# EAGLE design Jason_BlinkyB (EAGLE 8.3.2)
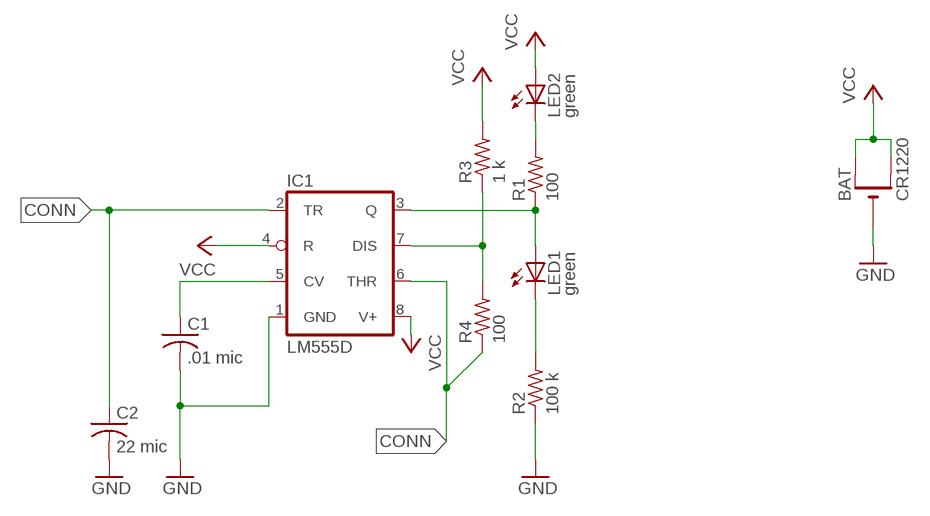
[diagram p0: schematic, sheet 1]

## Parts
BAT  CR1220  CR1220SMT  [CR1220-SMD]
C1  .01 mic  C-USC0805  [C0805]
C2  22 mic  C-USC0805  [C0805]
IC1  LM555D  [SO08]
LED1  green  LEDCHIPLED_0805  [CHIPLED_0805]
LED2  green  LEDCHIPLED_0805  [CHIPLED_0805]
R1  100  R-US_R0805  [R0805]
R2  100 k  R-US_R0805  [R0805]
R3  1 k  R-US_R0805  [R0805]
R4  100  R-US_R0805  [R0805]

## Nets
CONN: C2.1 IC1.2(TR) IC1.6(THR) R4.1
GND: BAT.- C1.2 C2.2 IC1.1(GND) R2.1
N$1: LED2.C R1.2
N$2: IC1.3(Q) LED1.A R1.1
N$3: LED1.C R2.2
N$4: IC1.7(DIS) R3.1 R4.2
N$9: C1.1 IC1.5(CV)
VCC: BAT.+$1(+) BAT.+$2(+1) IC1.4(R) IC1.8(V+) LED2.A R3.2

## Library data of the parts
BAT = adafruit:CR1220: CR1216/CR1220/CR1225 12mm 3V lithium coin cell Great for battery packup. Both SMT and THM holders. Note the THM package has the ground pads on both sides of the PCB so that the masks are the same - this reduces the cost; MPN: 3080; OC_NEWARK: 25T0433
C1 = adafruit:C-US: CAPACITOR, American symbol; MF: KEMET; MPN: C0805C103K5RACTU; OC_NEWARK: 01J3314
C2 = adafruit:C-US: CAPACITOR, American symbol; MPN: TL8W9226M010C; OC_NEWARK: 03AC0052
IC1 = adafruit:*555: TIMER Changed DIP package to have round (not oval) pin pads http://www.ladyada.net/library/pcb/eaglelibrary.html; MPN: TLC555CD.; OC_NEWARK: 50R6850
LED1 LED2 = led:LED: LED OSRAM: - CHIPLED LG R971, LG N971, LY N971, LG Q971, LY Q971, LO R971, LY R971 LH N974, LH R974 LS Q976, LO Q976, LY Q976 LO Q996 - Hyper CHIPLED LW Q18S LB Q993, LB Q99A, LB R99A - SideLED LS A670, LO A670, LY A670, LG A670, LP A670 LB A673, LV A673, LT A673, LW A673 LH A674 LY A675 LS A676, LA A676, LO A676, LY A676, LW A676 LS A679, LY A679, LG A679 - Hyper Micro SIDELED® LS Y876, LA Y876, LO Y876, LY Y876 LT Y87S - SmartLED LW L88C, LW L88S LB L89C, LB L89S, LG L890 LS L89K, LO L89K, LY L89K LS L896, LA L896, LO L896, LY L896 - TOPLED LS T670, LO T670, LY T670, LG T670, LP T670 LSG T670, LSP T670, LSY T670, LOP T670, LYG T670 LG T671, LOG T671, LSG T671 LB T673, LV T673, LT T673, LW T673 LH T674 LS T676, LA T676, LO T676, LY T676, LB T676, LH T676, LSB T676, LW T676 LB T67C, LV T67C, LT T67C, LS T67K, LO T67K, LY T67K, LW E67C LS E67B, LA E67B, LO E67B, LY E67B, LB E67C, LV E67C, LT E67C LW T67C LS T679, LY T679, LG T679 LS T770, LO T770, LY T770, LG T770, LP T770 LB T773, LV T773, LT T773, LW T773 LH T774 LS E675, LA E675, LY E675, LS T675 LS T776, LA T776, LO T776, LY T776, LB T776 LHGB T686 LT T68C, LB T68C - Hyper Mini TOPLED® LB M676 - Mini TOPLED Santana® LG M470 LS M47K, LO M47K, LY M47K Source: http://www.osram.convergy.de LUXEON: - LUMILED® LXK2-PW12-R00, LXK2-PW12-S00, LXK2-PW14-U00, LXK2-PW14-V00 LXK2-PM12-R00, LXK2-PM12-S00, LXK2-PM14-U00 LXK2-PE12-Q00, LXK2-PE12-R00, LXK2-PE12-S00, LXK2-PE14-T00, LXK2-PE14-U00 LXK2-PB12-K00, LXK2-PB12-L00, LXK2-PB12-M00, LXK2-PB14-N00, LXK2-PB14-P00, LXK2-PB14-Q00 LXK2-PR12-L00, LXK2-PR12-M00, LXK2-PR14-Q00, LXK2-PR14-R00 LXK2-PD12-Q00, LXK2-PD12-R00, LXK2-PD12-S00 LXK2-PH12-R00, LXK2-PH12-S00 LXK2-PL12-P00, LXK2-PL12-Q00, LXK2-PL12-R00 Source: www.luxeon.com KINGBRIGHT: KA-3528ASYC Source: www.kingbright.com; MPN: 150080GS75000; OC_NEWARK: 95W3800
R1 R4 = rcl:R-US_: RESISTOR, American symbol; MPN: CR0805-JW-101ELF; OC_NEWARK: 06X5173
R2 = rcl:R-US_: RESISTOR, American symbol; MF: FARNELL; MPN: MC01W08055100K; OC_NEWARK: 39K0331
R3 = rcl:R-US_: RESISTOR, American symbol; MF: VISHAY/DALE; MPN: CRCW08051K00FKTA; OC_NEWARK: 05F1507

## Net classes
0 default: width 0.305 mm, drill 0.508 mm, clearance 0.254 mm

## Board
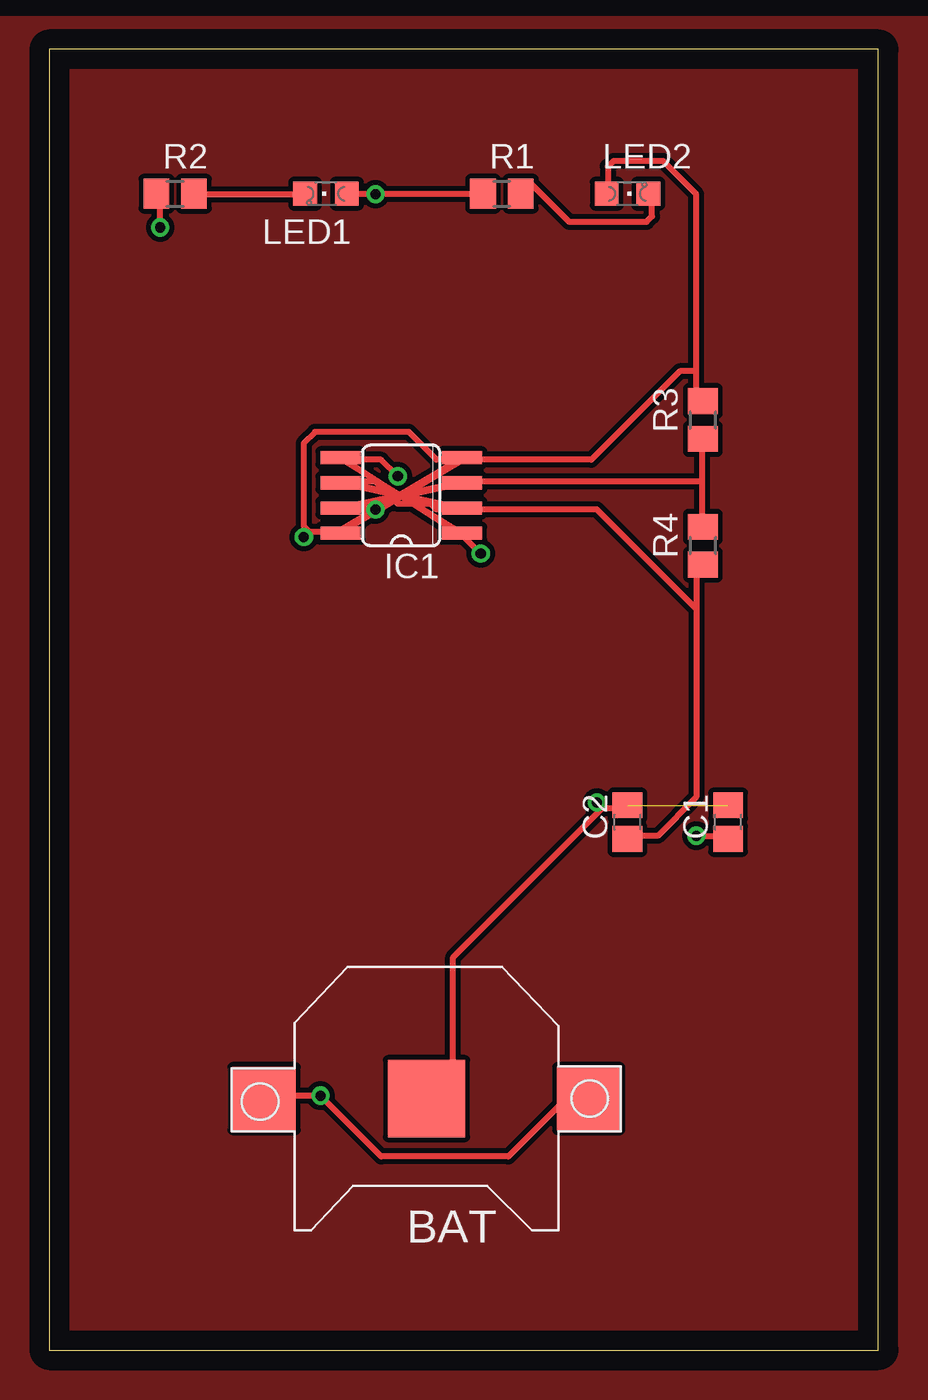
[diagram p1: board, top side]
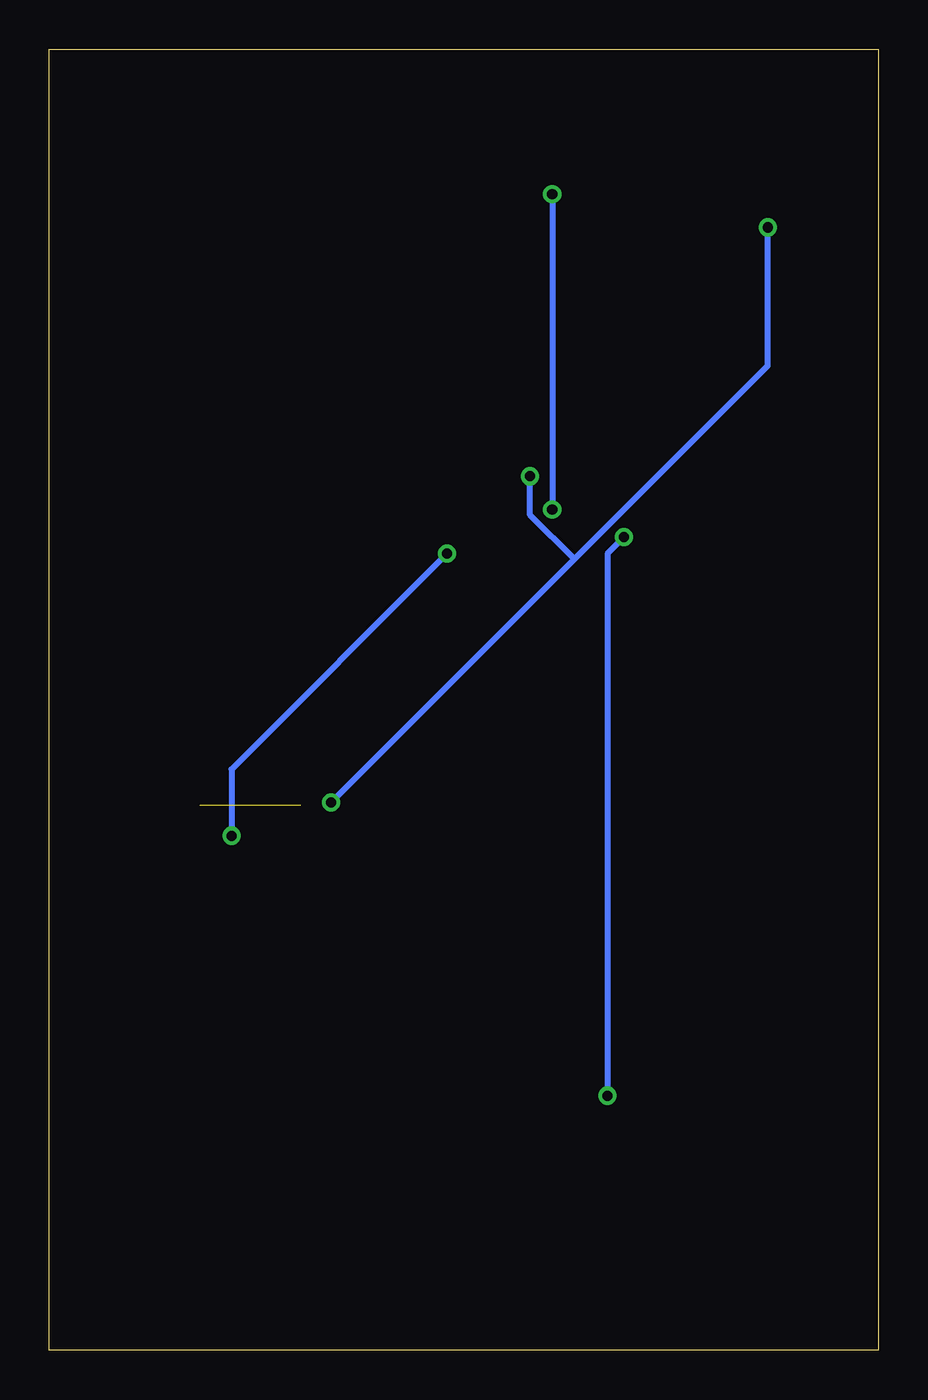
[diagram p2: board, bottom side, seen from below]

Size 41.89 x 65.71 mm. Coordinates in mm from the lower left corner, seen from the top.
Outline: 0,0 41.89,0 41.89,65.71 0,65.71 0,0
Copper layers (1*16): Top 0.035mm / dielectric 1.5mm / Bottom 0.035mm
Design rules "default": minimum track width 6mil, minimum drill 0.35mm, track to track 6mil, track to pad 6mil, pad to pad 6mil, via to via 6mil, smd to smd 6mil, copper to edge 40mil, drill to drill 6mil, minimum pad ring 10mil, minimum via ring 8mil, stop-mask expansion 4mil, vias tented up to drill 0mil, thermal gap 10mil

### Footprints (pad centres in the part's own frame; a part is rotated, then mirrored left to right if it is on the bottom)
CR1220-SMD = smd 3.2 x 3.2: +$1 -8.2,0; +$2 8.2,0 | smd 3.9 x 3.9: - 0,0
C0805 = smd 1.3 x 1.5: 1 -0.85,0; 2 0.85,0
SO08 = smd 0.66 x 2.032: 1 -1.905,-3.073; 2 -0.635,-3.073; 3 0.635,-3.073; 4 1.905,-3.073; 5 1.905,3.073; 6 0.635,3.073; 7 -0.635,3.073; 8 -1.905,3.073
CHIPLED_0805 = smd 1.2 x 1.2: A 0,-1.05; C 0,1.05
R0805 = smd 1.3 x 1.5: 1 -0.95,0; 2 0.95,0

### Placement (x,y rotation side)
BAT  19.05,12.7 180 top
C1  34.29,26.67 90 top
C2  29.21,26.67 90 top
IC1  17.78,43.18 90 top
LED1  13.97,58.42 90 top
LED2  29.21,58.42 270 top
R1  22.86,58.42 0 top
R2  6.35,58.42 0 top
R3  33.02,46.99 90 top
R4  33.02,40.64 90 top

### Tracks (layer width: path | path; a pad name or v marks a point on that pad's centre or on a via)
CONN
  Top 0.305: IC1.2 14.81,43.87 16.48,43.87 17.6,42.75 19.28,42.75 19.56,42.47 20.68,42.47 IC1.6 20.95,42.47 27.66,42.47 32.69,37.44 | 32.69,37.44 32.69,39.4 32.97,39.67 R4.1 | 32.69,37.44 32.69,27.94 30.73,25.98 29.34,25.98 C2.1
GND  (via drill 0.51)  (1 unrouted)
  Top 0.305: 27.94,27.38 29.06,27.38 C2.2 | 27.94,27.38 20.4,19.84 20.4,13.97 19.28,12.85 BAT.- | v5.59,56.72 5.59,58.4 R2.1 | 27.94,27.38 v27.66,27.66 | v17.6,44.15 16.76,44.98 14.81,44.98 IC1.1
  Bottom 0.305: v5.59,56.72 5.59,49.73 15.37,39.95 | v27.66,27.66 15.37,39.95 | v17.6,44.15 17.6,42.19 15.37,39.95
GNG
  pour Top: -2.54,67.31 -2.54,-2.54 44.45,-2.54 44.45,67.31
N$1
  Top 0.305: LED2.C 30.45,58.4 30.45,57.28 30.18,57 26.26,57 24.31,58.95 24.03,58.95 23.75,58.67 R1.2
N$2  (via drill 0.51)
  Top 0.305: LED1.A 15.09,58.4 v16.48,58.4 21.79,58.4 R1.1 | v16.48,42.47 14.81,42.47 IC1.3
  Bottom 0.305: v16.48,58.4 v16.48,42.47
N$3
  Top 0.305: LED1.C 12.85,58.4 7.82,58.4 7.54,58.12 7.26,58.4 R2.2
N$4
  Top 0.305: 32.97,43.87 32.97,45.54 32.69,45.82 32.97,46.1 R3.1 | 32.97,43.87 32.97,41.63 R4.2 | 32.97,43.87 20.95,43.87 IC1.7
N$9  (via drill 0.51)
  Top 0.305: v32.69,25.98 34.09,25.98 C1.1 | v21.79,40.23 20.95,41.07 IC1.5
  Bottom 0.305: v32.69,25.98 32.69,29.34 v21.79,40.23
VCC  (via drill 0.51)
  Top 0.305: BAT.+$2 10.9,12.85 v13.69,12.85 16.76,9.78 23.19,9.78 25.98,12.57 27.1,12.57 BAT.+$1 | 13.13,41.35 14.53,41.35 IC1.4 | 13.13,41.35 12.85,41.63 12.85,45.82 13.41,46.38 18.16,46.38 19.56,44.98 20.68,44.98 IC1.8 20.95,44.98 27.38,44.98 31.85,49.45 32.69,49.45 | 32.69,49.45 32.69,48.34 32.97,48.06 R3.2 | 32.69,49.45 32.69,58.4 31.01,60.07 28.5,60.07 28.22,59.79 28.22,58.67 LED2.A | 13.13,41.35 v12.85,41.07
  Bottom 0.305: v13.69,12.85 13.69,40.23 v12.85,41.07